# Altium schematic sheet IO and Comm.SchDoc
size A4; SheetNumber: 3; SheetTotal: 4; SPICEModelCacheCCCFIGUR: <root> / <DocumentId>CCCFIGUR</DocumentId> / </root>
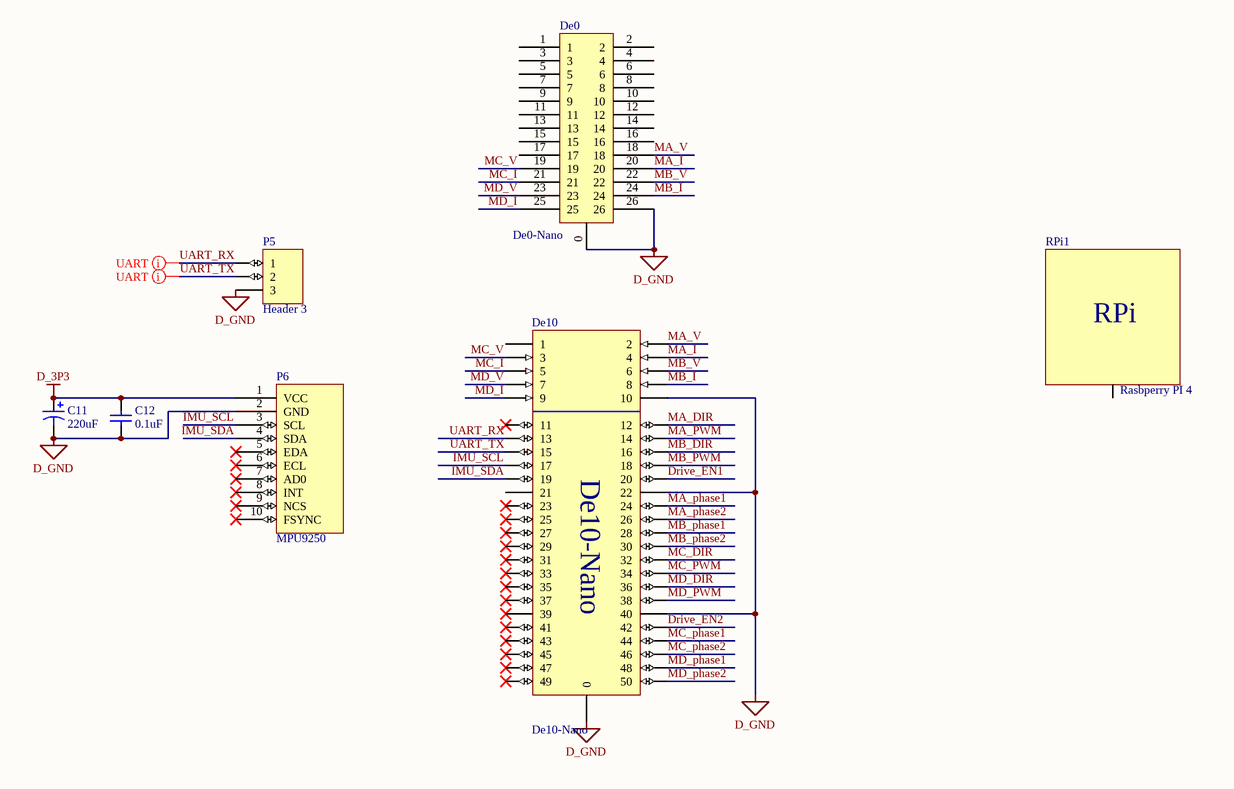
[diagram p0: IO and Comm.SchDoc]

## Parts
C11  220uF  [VZT221M1ETR-0607]
C12  0.1uF  [CL10B104KA8NNNC]
De0  De0-Nano  [DE0-Nano]
De10  De10-Nano  [De10-Nano]
P5  Header 3  [B3B-XH-A(LF)(SN)]
P6  MPU9250  [MPU9250]
RPi1  Rasbperry PI 4  [Raspberry Pi 4]

## Nets
D_3P3: C11.1 C12.2 P6.1(VCC)
D_GND: C11.2 C12.1 De0.0 De0.26 De10.0 De10.10 De10.22 De10.40 P5.3 P6.2(GND)
Drive_EN1: De10.20
Drive_EN2: De10.42
IMU_SCL: De10.17 P6.3(SCL)
IMU_SDA: De10.19 P6.4(SDA)
MA_DIR: De10.12
MA_I: De0.20 De10.4
MA_phase1: De10.24
MA_phase2: De10.26
MA_PWM: De10.14
MA_V: De0.18 De10.2
MB_DIR: De10.16
MB_I: De0.24 De10.8
MB_phase1: De10.28
MB_phase2: De10.30
MB_PWM: De10.18
MB_V: De0.22 De10.6
MC_DIR: De10.32
MC_I: De0.21 De10.5
MC_phase1: De10.44
MC_phase2: De10.46
MC_PWM: De10.34
MC_V: De0.19 De10.3
MD_DIR: De10.36
MD_I: De0.25 De10.9
MD_phase1: De10.48
MD_phase2: De10.50
MD_PWM: De10.38
MD_V: De0.23 De10.7
UART_RX: De10.13 P5.1
UART_TX: De10.15 P5.2

Not connected (* = marked no-connect by the designer): De0 1 2 3 4 5 6 7 8 9 10 11 12 13 14 15 16 17; De10 1 11* 21 23* 25* 27* 29* 31* 33* 35* 37* 39* 41* 43* 45* 47* 49*; P6 5(EDA)* 6(ECL)* 7(AD0)* 8(INT)* 9(NCS)* 10(FSYNC)*; RPi1 1

## Layout directives
net class UART; rule Length Constraint [Min Length = 60mm    Max Length = 61mm]: UART_RX, UART_TX

## Notes on the sheet
- (in symbol Rasbperry PI 4) RPi

## Library data of the parts
C11 = Cap Pol1: -45℃~+105℃ 2000hrs@105℃ 220uF 7.7mm 25V 6.3mm ±20% SMD,6.3x7.7mm  Aluminum Electrolytic Capacitors - SMD ROHS; Published: 8-Jun-2000; LatestRevisionDate: 17-Jul-2002; LatestRevisionNote: Re-released for DXP Platform.; PackageReference: RB7.6-15; Publisher: Altium Limited; PackageDescription: Polarized Capacitor (Radial); 2 Leads
C12 = Cap Semi: 25V 100nF X7R ±10% 0603  Multilayer Ceramic Capacitors MLCC - SMD/SMT ROHS; Published: 8-Jun-2000; LatestRevisionDate: 29-May-2009; LatestRevisionNote: IPC-7351 Footprint Added.; PackageReference: C1206; Publisher: Altium Limited; PackageDescription: Chip Capacitor
P5 = Header 3: 1x3P XH 1 2.5mm 3 Brass Plugin,P=2.5mm  Wire To Board / Wire To Wire Connector ROHS; LatestRevisionDate: 17-Jul-2002; LatestRevisionNote: Re-released for DXP Platform.; Publisher: Altium Limited
P6 = MPU9250: 9DOF, 3 Axis Gyro, Acceleration, Magmetic